# Altium project 00.Template.PrjPcb
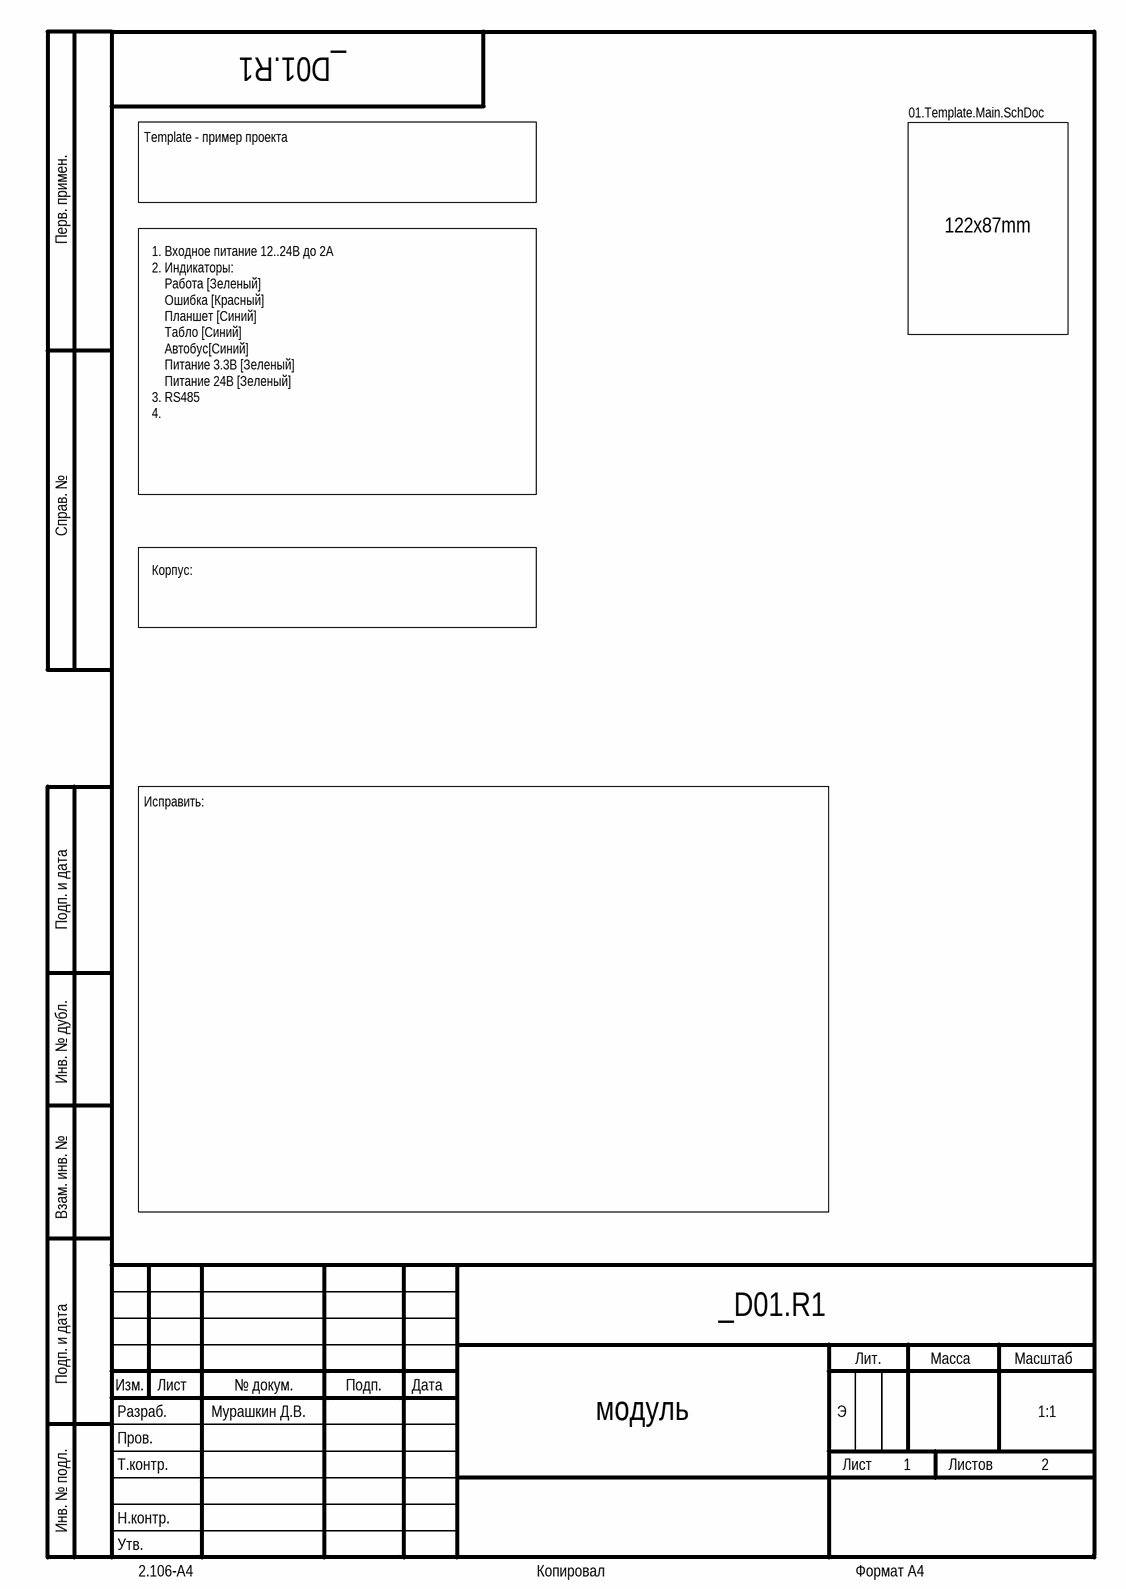
[diagram p0: 01.Template.Title.SchDoc]
7 sheets, 39 parts. Net scope: strictly hierarchical (ports join the sheet entries above them; power ports are local).
Board file: 01.Template.pcbdoc
Sheets:
  01.Template.Title.SchDoc
    01.Template.Main = 01.Template.Main.SchDoc
      MCU = 03.Template.MCU.SchDoc
        Template.MCU-sub.Power.Clock.Debug = 03.Template.MCU-sub.Power.Clock.Debug.SchDoc
      Template_connection = 02.Template_connection.SchDoc
      Debug = 03.Template_Debug.SchDoc
      Indication = 03.Template_Indication.SchDoc

## Sheet 01.Template.Title.SchDoc
size 209 x 297 mm; Author: Мурашкин Д.В.; DocumentNumber: _D01.R1; SheetNumber: 1; SheetTotal: 2; Scale: 1:1; Letter1Column: Э; PartName: модуль; DocumentsNumber: _D01.R1

### Sub-sheets
01.Template.Main = 01.Template.Main.SchDoc: no entries

### Notes on the sheet
- Template - пример проекта
- 122x87mm
- 1. Входное питание 12..24В до 2А
  2. Индикаторы:
  Работа [Зеленый]
  Ошибка [Красный]
  Планшет [Синий]
  Табло [Синий]
  Автобус[Синий]
  Питание 3.3В [Зеленый]
  Питание 24В [Зеленый]
  3. RS485
  4.
- Корпус:
- Исправить:
- Перв. примен.
- Справ. №
- Подп. и дата
- Инв. № дубл.
- Взам. инв. №
- Разраб.
- Изм.
- Лист
- № докум.
- Подп.
- Дата
- Лит.
- Масса
- Масштаб
- Пров.
- Т.контр.
- Листов
- Инв. № подл.
- Утв.
- Н.контр.
- 2.106-A4
- Копировал
- Формат А4

## Sheet 01.Template.Main.SchDoc
size 209 x 297 mm; Author: Мурашкин Д.В.; DocumentNumber: _D01.R1; SheetNumber: 2; SheetTotal: 7; Scale: 1:1; Letter1Column: Э; PartName: Блок схема
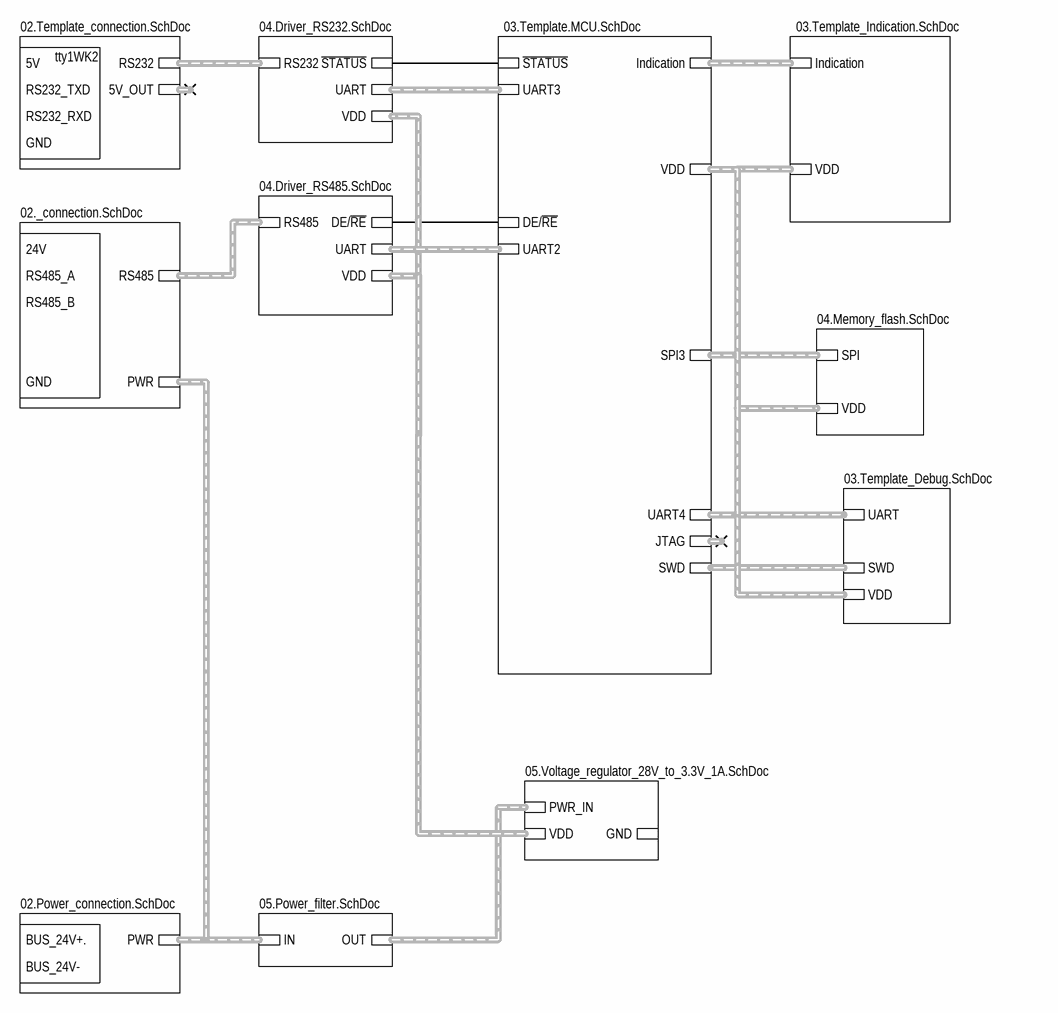
[diagram p1: 01.Template.Main.SchDoc]

### Sub-sheets
_connection = 02._connection.SchDoc (file not in this document): RS485 (harness RS485), PWR (harness PWR)
Debug = 03.Template_Debug.SchDoc: SWD (harness SWD), VDD (harness VDD), UART
Driver_RS232 = 04.Driver_RS232.SchDoc (file not in this document): UART (harness UART), RS232 (harness RS232), VDD (harness VDD), ~{STATUS}
Driver_RS485 = 04.Driver_RS485.SchDoc (file not in this document): RS485 (harness RS485), DE/~{RE}, VDD (harness VDD), UART (harness UART)
Indication = 03.Template_Indication.SchDoc: Indication (harness Indication), VDD (harness VDD)
MCU = 03.Template.MCU.SchDoc: VDD (harness VDD), Indication (harness Indication), UART3 (harness UART), UART2 (harness UART), JTAG (harness JTAG), SWD (harness SWD), SPI3 (harness SPI), DE/~{RE}, ~{STATUS}, UART4 (harness UART)
Memory_flash_MB = 04.Memory_flash.SchDoc (file not in this document): SPI (harness SPI), VDD (harness VDD)
Power_connection = 02.Power_connection.SchDoc (file not in this document): PWR (harness PWR)
Power_filter = 05.Power_filter.SchDoc (file not in this document): OUT (harness PWR), IN (harness PWR)
Template_connection = 02.Template_connection.SchDoc: RS232 (harness RS232), 5V_OUT (harness 5V)
VR_3.3V_1A = 05.Voltage_regulator_28V_to_3.3V_1A.SchDoc (file not in this document): VDD (harness VDD), PWR_IN (harness PWR), GND

### Nets
(unnamed): sheet MCU/DE/~{RE}, sheet Driver_RS485/DE/~{RE}
(unnamed): sheet MCU/~{STATUS}, sheet Driver_RS232/~{STATUS}

### Buses and harness runs
harness sheet _connection/PWR = sheet Power_connection/PWR = sheet Power_filter/IN
harness sheet _connection/RS485 = sheet Driver_RS485/RS485
harness sheet Debug/SWD = sheet MCU/SWD
harness sheet Debug/UART = sheet MCU/UART4
harness sheet Debug/VDD = sheet Indication/VDD = sheet MCU/VDD = sheet Memory_flash_MB/VDD
harness sheet Driver_RS232/RS232 = sheet Template_connection/RS232
harness sheet Driver_RS232/UART = sheet MCU/UART3
harness sheet Driver_RS232/VDD = sheet Driver_RS485/VDD = sheet VR_3.3V_1A/VDD
harness sheet Driver_RS485/UART = sheet MCU/UART2
harness sheet Indication/Indication = sheet MCU/Indication
harness sheet MCU/SPI3 = sheet Memory_flash_MB/SPI
harness sheet Power_filter/OUT = sheet VR_3.3V_1A/PWR_IN

### Notes on the sheet
- 5V
- RS232_TXD
- tty1WK2
- RS232_RXD
- GND
- 24V
- RS485_A
- RS485_B
- BUS_24V+.
- BUS_24V-
- Подп. и дата
- Инв. № дубл.
- Взам. инв. №
- Инв. № подл.
- Изм.
- Лист
- № докум.
- Подп.
- Дата
- 2.106-A4
- Копировал
- Формат А4

## Sheet 03.Template.MCU.SchDoc
size 209 x 297 mm; PartName: Микроконтроллер; Author: Мурашкин Д.В.; DocumentNumber: _D01.R1; SheetNumber: 4; SheetTotal: 4; Scale: 1:1; Letter1Column: Э; DocumentsNumber: _D01.R1
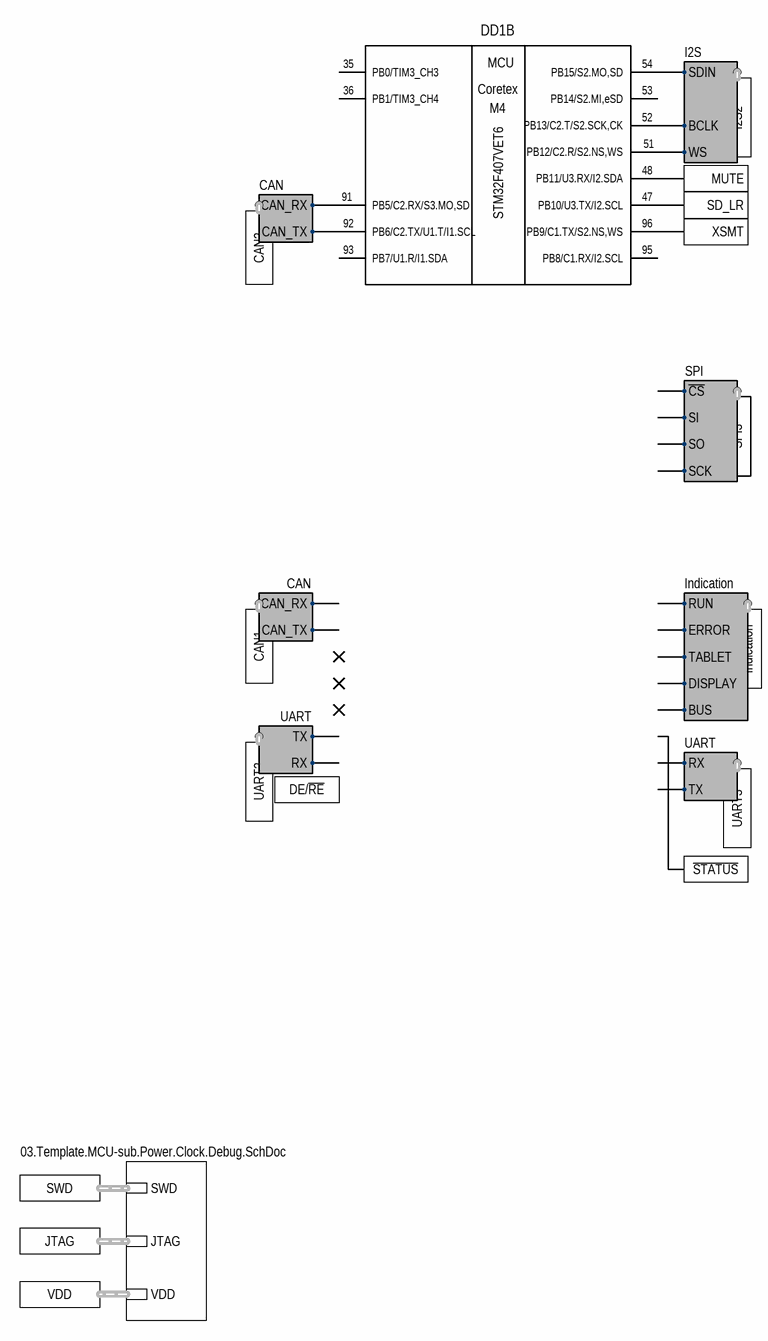
[diagram p2: 03.Template.MCU.SchDoc]

### Parts
DD1  STM32F407VET6  [LQFP-100N]  (part B of 7)

### Sub-sheets
Template.MCU-sub.Power.Clock.Debug = 03.Template.MCU-sub.Power.Clock.Debug.SchDoc: VDD (harness VDD), JTAG (harness JTAG), SWD (harness SWD)

### Ports
CAN1 (harness CAN), CAN2 (harness CAN), DE/~{RE}, I2S2 (harness I2S), Indication (harness Indication), JTAG (harness JTAG), MUTE, SD_LR, SPI3 (harness SPI), SWD (harness SWD), UART2 (harness UART), UART3 (harness UART), VDD (harness VDD), XSMT, ~{STATUS}

### Harnesses
I2S: BCLK, WS, SDIN
UART: TX, RX
CAN: CAN_RX, CAN_TX
SPI: SI, SO, SCK, ~{CS}
Indication: RUN, TABLET, ERROR, DISPLAY, BUS

### Nets
NetDD1_47: DD1.47(PB10/U3.TX/I2.SCL) ; port SD_LR
NetDD1_48: DD1.48(PB11/U3.RX/I2.SDA) ; port MUTE
NetDD1_51: DD1.51(PB12/C2.R/S2.NS,WS) ; port I2S2.WS
NetDD1_52: DD1.52(PB13/C2.T/S2.SCK,CK) ; port I2S2.BCLK
NetDD1_54: DD1.54(PB15/S2.MO,SD) ; port I2S2.SDIN
NetDD1_91: DD1.91(PB5/C2.RX/S3.MO,SD) ; port CAN2.CAN_RX
NetDD1_92: DD1.92(PB6/C2.TX/U1.T/I1.SCL) ; port CAN2.CAN_TX
NetDD1_96: DD1.96(PB9/C1.TX/S2.NS,WS) ; port XSMT

Not connected (* = marked no-connect by the designer): DD1 35(PB0/TIM3_CH3) 36(PB1/TIM3_CH4) 53(PB14/S2.MI,eSD) 93(PB7/U1.R/I1.SDA) 95(PB8/C1.RX/I2.SCL)

### Buses and harness runs
harness port JTAG = sheet Template.MCU-sub.Power.Clock.Debug/JTAG
harness port SWD = sheet Template.MCU-sub.Power.Clock.Debug/SWD
harness port VDD = sheet Template.MCU-sub.Power.Clock.Debug/VDD

### Notes on the sheet
- Подп. и дата
- Инв. № дубл.
- Взам. инв. №
- Инв. № подл.
- Изм.
- Лист
- № докум.
- Подп.
- Дата
- 2.106-A4
- Копировал
- Формат А4
- (in symbol STM32F407VET6, part B) MCU; Coretex; M4

### Library data of the parts
DD1 = STM32F407VET6: Microcontroller STM32F4 32b 168MHz 512kB Cortex-M4 LQFP-100; Manufacturer: STMicroelectronics; Core count: 1; SRAM: 192kB; Peripherals: BOD, WDT, PWM, RTC, ADC, DAC, DMA, LCD; Interfaces: GPIO, UART, SPI, JTAG, I2C, I2S, USB, CAN, LIN, DCMI, EBI/EMI, IrDA, Ethernet; Operating voltage Min: 1.8V; Operating voltage Max: 3.6V; Group: Digital; Item ID: STM32F407VET6; Part name: STM32F407VET6; Package: LQFP-100; Core: Cortex-M4; Core frequency Max: 168MHz; FLASH: 512kB; Operating temperature Min: -40°C; Operating temperature Max: +85°C; Width: 16.0mm; Length: 16.0mm; Height: 1.6mm; Mounting type: Surface mount; Supplier 1: LCSC; Supplier Part Number 1: C28730; Datasheet URL: https://www.st.com/resource/en/datasheet/stm32f407vg.pdf; Component URL: https://www.st.com/en/microcontrollers-microprocessors/stm32f407ve.html; Component: Microcontrollers; Category: STM32

## Sheet 03.Template.MCU-sub.Power.Clock.Debug.SchDoc
size 209 x 297 mm; PartName: Микроконтроллер. Подсхема ПТО; Author: Мурашкин Д.В.; DocumentNumber: _D01.R1; SheetNumber: 1; SheetTotal: 4; Scale: 1:1; Letter1Column: Э; DocumentsNumber: _D01.R1
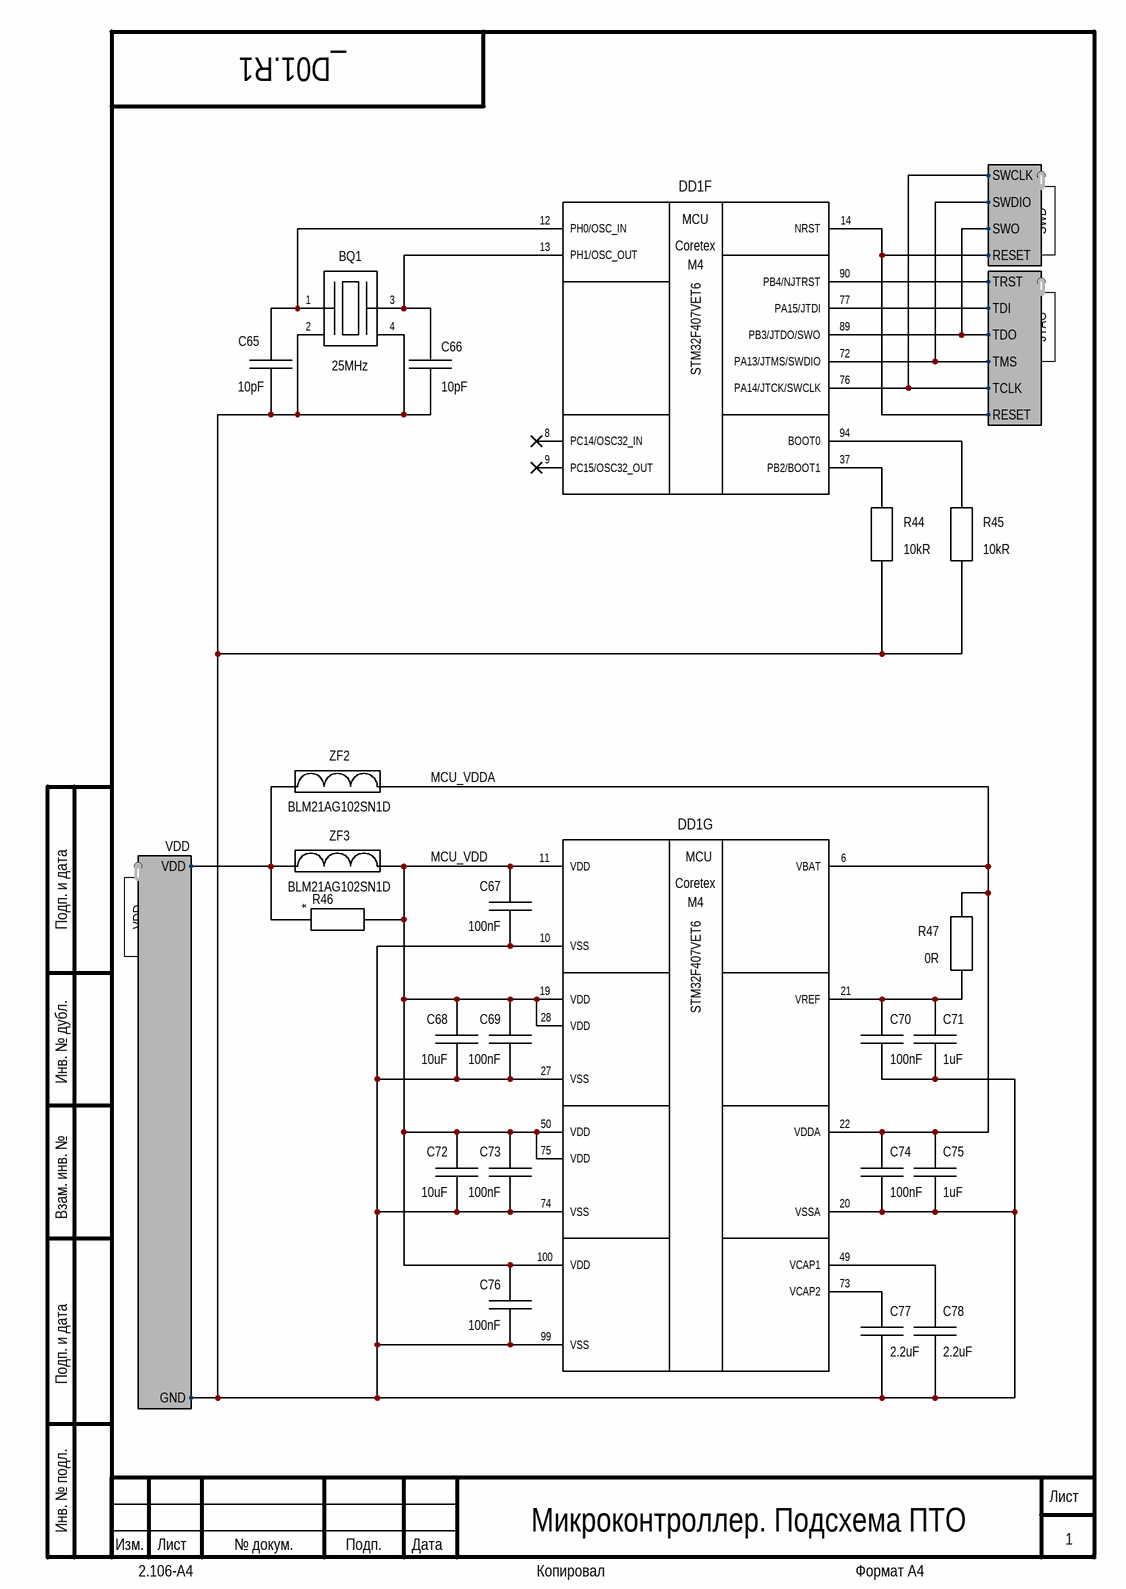
[diagram p3: 03.Template.MCU-sub.Power.Clock.Debug.SchDoc]

### Parts
BQ1  25MHz  [CRYST3225-4N]
C65  10pF  [CAPC2012N]
C66  10pF  [CAPC2012N]
C67  100nF  [CAPC2012N]
C68  10uF  [CAPC2012N]
C69  100nF  [CAPC2012N]
C70  100nF  [CAPC2012N]
C71  1uF  [CAPC2012N]
C72  10uF  [CAPC2012N]
C73  100nF  [CAPC2012N]
C74  100nF  [CAPC2012N]
C75  1uF  [CAPC2012N]
C76  100nF  [CAPC2012N]
C77  2.2uF  [CAPC2012N]
C78  2.2uF  [CAPC2012N]
DD1  STM32F407VET6  [LQFP-100N]  (parts F,G of 7)
R44  10kR  [RESC2012N]
R45  10kR  [RESC2012N]
R46  (no value)  [RESC2012N-NM]  (no BOM)
R47  0R  [RESC2012N]
ZF2  BLM21AG102SN1D  [FERB2012N]
ZF3  BLM21AG102SN1D  [FERB2012N]

### Ports
JTAG (harness JTAG), SWD (harness SWD), VDD (harness VDD)

### Harnesses
VDD: VDD, GND
JTAG: TMS, TDO, TDI, TRST, TCLK, RESET
SWD: SWCLK, SWO, SWDIO, RESET

### Nets
MCU_VDD: C67.1 C68.1 C69.1 C72.1 C73.1 C76.1 DD1.11(VDD) DD1.19(VDD) DD1.28(VDD) DD1.50(VDD) DD1.75(VDD) DD1.100(VDD) R46.2 ZF3.2
MCU_VDDA: C74.1 C75.1 DD1.6(VBAT) DD1.22(VDDA) R47.1 ZF2.2
Net3.3V_1: BQ1.2 BQ1.4 C65.2 C66.2 C67.2 C68.2 C69.2 C70.2 C71.2 C72.2 C73.2 C74.2 C75.2 C76.2 C77.2 C78.2 DD1.10(VSS) DD1.20(VSSA) DD1.27(VSS) DD1.74(VSS) DD1.99(VSS) R44.2 R45.2 ; port VDD.GND
NetBQ1_1: BQ1.1 C65.1 DD1.12(PH0/OSC_IN)
NetBQ1_3: BQ1.3 C66.1 DD1.13(PH1/OSC_OUT)
NetC70_1: C70.1 C71.1 DD1.21(VREF) R47.2
NetC77_1: C77.1 DD1.73(VCAP2)
NetC78_1: C78.1 DD1.49(VCAP1)
NetDD1_14: DD1.14(NRST) ; port JTAG.RESET, port SWD.RESET
NetDD1_37: DD1.37(PB2/BOOT1) R44.1
NetDD1_72: DD1.72(PA13/JTMS/SWDIO) ; port JTAG.TMS, port SWD.SWDIO
NetDD1_76: DD1.76(PA14/JTCK/SWCLK) ; port JTAG.TCLK, port SWD.SWCLK
NetDD1_77: DD1.77(PA15/JTDI) ; port JTAG.TDI
NetDD1_89: DD1.89(PB3/JTDO/SWO) ; port JTAG.TDO, port SWD.SWO
NetDD1_90: DD1.90(PB4/NJTRST) ; port JTAG.TRST
NetDD1_94: DD1.94(BOOT0) R45.1
NetR11_1: R46.1 ZF2.1 ZF3.1 ; port VDD.VDD

Not connected (* = marked no-connect by the designer): DD1 8(PC14/OSC32_IN)* 9(PC15/OSC32_OUT)*

### Notes on the sheet
- Подп. и дата
- Инв. № дубл.
- Взам. инв. №
- Инв. № подл.
- Изм.
- Лист
- № докум.
- Подп.
- Дата
- 2.106-A4
- Копировал
- Формат А4
- (in symbol STM32F407VET6, part F) MCU; Coretex; M4
- (in symbol STM32F407VET6, part G) MCU; Coretex; M4

### Library data of the parts
BQ1 = X322525MMB4SI: Crystal 25MHz 10pF; Manufacturer: YXC; Group: Discrete; ESR: 50kOhm; Frequency tolerance: ±10ppm; Component: Oscillators; Part name: X322525MMB4SI; Package: 3225; Frequency: 25MHz; Height: 0.75mm; Operating temperature: -40°C +85°C; Load capacitance: 10pF; Mounting type: Surface mount; Dimension: 3.20mm x 2.50mm; Item ID: X322525MMB4SI; Operating temperature Min: -40°C; Operating temperature Max: +85°C; Width: 5.2mm; Length: 2.5mm; Supplier 1: LCSC; Supplier Part Number 1: C70582; Datasheet URL: https://datasheet.lcsc.com/lcsc/2304140030_YXC-X322525MMB4SI_C70582.pdf; Category: Crystal; Value: 25MHz
C65 C66 = 0805CG100J500NT: Capacitor Ceramic 10pF 50V C0G 2012; Manufacturer: FH; Tolerance: ±5%; Group: Discrete; Component: Capacitors; Value: 10pF/50V; Value code: 100; Item ID: 0805CG100J500NT; Part name: 0805CG100J500NT; Package: 2012; Capacitance: 10pF; Voltage: 50V; Dielectric: C0G; Technology: Multi layer; Operating temperature Min: -55°C; Operating temperature Max: +125°C; Width: 1.25mm; Length: 2.0mm; Height: 0.55mm; Mounting type: Surface mount; Supplier 1: LCSC; Supplier Part Number 1: C157608; Datasheet URL: https://datasheet.lcsc.com/lcsc/2304140030_FH--Guangdong-Fenghua-Advanced-Tech-0805CG100J500NT_C157608.pdf?_gl=1*1oyk1cl*_ga*MTk2MTgyMTQ2NS4xNzA5MTMzOTYz*_ga_98M84MKSZH*MTcwOTE0MzQwMS4yLjEuMTcwOTE0NjgyMy42MC4wLjA.; Category: Ceramic
C67 C69 C70 C73 C74 C76 = 0805B104K500NT: Capacitor Ceramic 100nF 50V X7R 2012; Manufacturer: FH; Tolerance: ±10%; Group: Discrete; Component: Capacitors; Value: 100nF/50V; Value code: 104; Item ID: 0805B104K500NT; Part name: 0805B104K500NT; Package: 2012; Capacitance: 100nF; Voltage: 50V; Dielectric: X7R; Technology: Multi layer; Operating temperature Min: -55°C; Operating temperature Max: +125°C; Width: 1.25mm; Length: 2.0mm; Height: 0.8mm; Mounting type: Surface mount; Supplier 1: LCSC; Supplier Part Number 1: C38141; Datasheet URL: https://datasheet.lcsc.com/lcsc/2304140030_FH--Guangdong-Fenghua-Advanced-Tech-0805B103K500NT_C52278.pdf?_gl=1*18q9nu3*_ga*MTk2MTgyMTQ2NS4xNzA5MTMzOTYz*_ga_98M84MKSZH*MTcwOTE0MzQwMS4yLjEuMTcwOTE0NzM5MC43LjAuMA..; Category: Ceramic
C68 C72 = GRM21BR61H106KE43L: Capacitor Ceramic 10uF 50V X5R 2012; Manufacturer: Murata Electronics; Tolerance: ±10%; Group: Discrete; Component: Capacitors; Value: 10uF/50V; Value code: 106; Item ID: GRM21BR61H106KE43L; Part name: GRM21BR61H106KE43L; Package: 2012; Capacitance: 10uF; Voltage: 50V; Dielectric: X5R; Technology: Multi layer; Operating temperature Min: -55°C; Operating temperature Max: +85°C; Width: 1.25mm; Length: 2.0mm; Height: 1.25mm; Mounting type: Surface mount; Supplier 1: LCSC; Supplier Part Number 1: C440198; Datasheet URL: https://datasheet.lcsc.com/lcsc/2310251059_Murata-Electronics-GRM21BR61H106KE43L_C440198.pdf?_gl=1*1lxpbko*_ga*MTk2MTgyMTQ2NS4xNzA5MTMzOTYz*_ga_98M84MKSZH*MTcwOTE0MzQwMS4yLjEuMTcwOTE0NzE1NS42MC4wLjA.; Category: Ceramic
C71 C75 = 0805B105K500NT: Capacitor Ceramic 1uF 50V X7R 2012; Manufacturer: FH; Tolerance: ±10%; Group: Discrete; Component: Capacitors; Value: 1uF/50V; Value code: 105; Item ID: 0805B105K500NT; Part name: 0805B105K500NT; Package: 2012; Capacitance: 1uF; Voltage: 50V; Dielectric: X7R; Technology: Multi layer; Operating temperature Min: -55°C; Operating temperature Max: +125°C; Width: 1.25mm; Length: 2.0mm; Height: 0.8mm; Mounting type: Surface mount; Supplier 1: LCSC; Supplier Part Number 1: C215803; Datasheet URL: https://datasheet.lcsc.com/lcsc/2304140030_FH--Guangdong-Fenghua-Advanced-Tech-0805B103K500NT_C52278.pdf?_gl=1*18q9nu3*_ga*MTk2MTgyMTQ2NS4xNzA5MTMzOTYz*_ga_98M84MKSZH*MTcwOTE0MzQwMS4yLjEuMTcwOTE0NzM5MC43LjAuMA..; Category: Ceramic
C77 C78 = 0805X225K500NT: Capacitor Ceramic 2.2uF 50V X5R 2012; Manufacturer: FH; Tolerance: ±15%; Group: Discrete; Component: Capacitors; Value: 2.2uF/50V; Value code: 225; Item ID: 0805X225K500NT; Part name: 0805X225K500NT; Package: 2012; Capacitance: 2.2uF; Voltage: 50V; Dielectric: X5R; Technology: Multi layer; Operating temperature Min: -55°C; Operating temperature Max: +85°C; Width: 1.25mm; Length: 2.0mm; Height: 0.8mm; Mounting type: Surface mount; Supplier 1: LCSC; Supplier Part Number 1: C108719; Datasheet URL: https://datasheet.lcsc.com/lcsc/2304140030_FH--Guangdong-Fenghua-Advanced-Tech-0805X225K500NT_C108719.pdf?_gl=1*1vi7l0*_ga*MTk2MTgyMTQ2NS4xNzA5MTMzOTYz*_ga_98M84MKSZH*MTcwOTE0MzQwMS4yLjEuMTcwOTE0NzU5NC42MC4wLjA.; Category: Ceramic
DD1 = STM32F407VET6: as DD1 on sheet 03.Template.MCU; Item ID: STM32F407VET6; Part name: STM32F407VET6; Package: LQFP-100; Core: Cortex-M4; Core frequency Max: 168MHz; FLASH: 512kB; Operating temperature Min: -40°C; Operating temperature Max: +85°C; Width: 16.0mm; Length: 16.0mm; Height: 1.6mm; Mounting type: Surface mount; Supplier 1: LCSC; Supplier Part Number 1: C28730; Datasheet URL: https://www.st.com/resource/en/datasheet/stm32f407vg.pdf; Component URL: https://www.st.com/en/microcontrollers-microprocessors/stm32f407ve.html; Component: Microcontrollers; Category: STM32
R44 R45 = 0805W8F1002T5E: Resistor Ceramic 10kR 1% 2012; Manufacturer: UNI-ROYAL; Power: 125mW; Temperature coefficient: ±100ppm; Group: Discrete; Component: Resistors; Value code: 1002; Item ID: 0805W8F1002T5E; Part name: 0805W8F1002T5E; Package: 2012; Resistance: 10kR; Tolerance: ±1%; Technology: Thin film; Operating temperature Min: -55°C; Operating temperature Max: +125°C; Width: 1.25mm; Length: 2.0mm; Height: 0.55mm; Mounting type: Surface mount; Supplier 1: LCSC; Supplier Part Number 1: C17414; Datasheet URL: https://datasheet.lcsc.com/lcsc/2206010216_UNI-ROYAL-Uniroyal-Elec-0805W8F1912T5E_C17508.pdf?_gl=1*13rsoe6*_ga*MTk2MTgyMTQ2NS4xNzA5MTMzOTYz*_ga_98M84MKSZH*MTcwOTE1NjkxMy4zLjEuMTcwOTE1OTk5Ni41NS4wLjA.; Category: Ceramic; Value: 10kR
R46 = RESC NM 2012: Part name: RESC2012_NM; Mounting type: Not mount; Group: Discrete; Component: Resistors; Item ID: RESC NM 2012; Package: 2012; Width: 2.0mm; Length: 1.25mm; Height: 0.55mm; Category: Ceramic
R47 = 0805W8F0000T5E: Resistor Ceramic 0R 1% 2012; Manufacturer: UNI-ROYAL; Power: 125mW; Temperature coefficient: ±100ppm; Group: Discrete; Component: Resistors; Value code: 0; Item ID: 0805W8F0000T5E; Part name: 0805W8F0000T5E; Package: 2012; Resistance: 0R; Tolerance: ±1%; Technology: Thin film; Operating temperature Min: -55°C; Operating temperature Max: +125°C; Width: 1.25mm; Length: 2.0mm; Height: 0.55mm; Mounting type: Surface mount; Supplier 1: LCSC; Supplier Part Number 1: C17477; Datasheet URL: https://datasheet.lcsc.com/lcsc/2206010216_UNI-ROYAL-Uniroyal-Elec-0805W8F0000T5E_C17477.pdf?_gl=1*s59qgl*_ga*MTk2MTgyMTQ2NS4xNzA5MTMzOTYz*_ga_98M84MKSZH*MTcwOTE1NjkxMy4zLjEuMTcwOTE1ODA5Mi42MC4wLjA.; Category: Ceramic; Value: 0R
ZF2 ZF3 = BLM21AG102SN1D: Ferrite Bead 0.6A 1k/100MHz 2012; Manufacturer: Murata Electronics; DC resistance: 280mOhm; Group: Discrete; Component: Filters; Impedance resistance: 1kOhm; Impedance frequency: 100MHz; Item ID: BLM21AG102SN1D; Part name: BLM21AG102SN1D; Package: 2012; Current rated: 0.6A; Operating temperature Min: -55°C; Operating temperature Max: +125°C; Width: 1.2mm; Length: 2.0mm; Height: 1.05mm; Mounting type: Surface mount; Supplier 1: LCSC; Supplier Part Number 1: C85835; Datasheet URL: https://www.murata.com/en-us/products/en-us/products/productdata/8796738977822/ENFA0005.pdf; Component URL: https://www.murata.com/en-global/products/productdetail?partno=BLM21AG102SN1%23; Category: Beads; Value: 0.6A

## Sheet 02.Template_connection.SchDoc
size 209 x 297 mm; Author: Мурашкин Д.В.; DocumentNumber: AB_BUSM_D01.R1; SheetNumber: 3; SheetTotal: 20; Scale: 1:1; Letter1Column: Э; PartName: Подключение к планшету; CompanyName: Innoforce.kz; DocumentsNumber: AB_BUSM_D01.R1
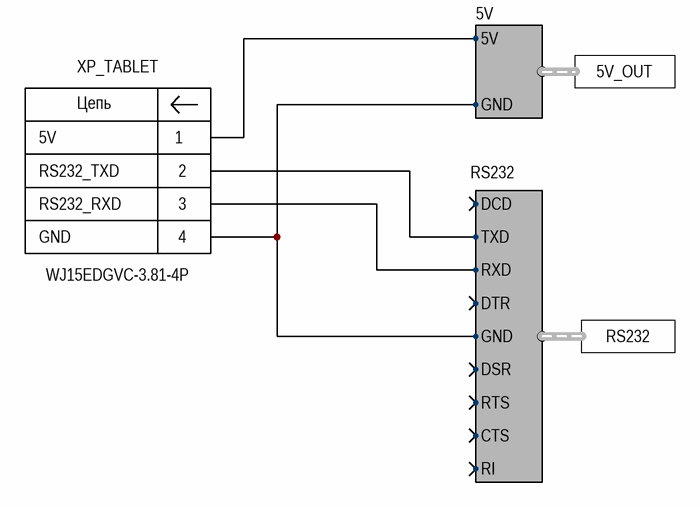
[diagram p4: 02.Template_connection.SchDoc]

### Parts
XP_TABLET  WJ15EDGVC-3.81-4P  [CON-TER-PLG-3.81-4V-TH-A-N]

### Ports
5V_OUT (harness 5V), RS232 (harness RS232)

### Harnesses
RS232: RXD, TXD, GND, DCD, DTR, DSR, RTS, CTS, RI
5V: 5V, GND

### Nets
NetXP_TABLET_1: XP_TABLET.1 ; port 5V_OUT.5V
NetXP_TABLET_2: XP_TABLET.2 ; port RS232.TXD
NetXP_TABLET_3: XP_TABLET.3 ; port RS232.RXD
NetXP_TABLET_4: XP_TABLET.4 ; port RS232.GND, port 5V_OUT.GND

### Notes on the sheet
- 5V
- RS232_TXD
- RS232_RXD
- GND
- Подп. и дата
- Инв. № дубл.
- Взам. инв. №
- Инв. № подл.
- Изм.
- Лист
- № докум.
- Подп.
- Дата
- 2.106-A4
- Копировал
- Формат А4
- (in symbol WJ15EDGVC-3.81-4P) Цепь

### Library data of the parts
XP_TABLET = WJ15EDGVC-3.81-4P: TERM BLOCK 3.81 VERT BOARD; Manufacturer: Ningbo Kangnex Elec; Pitch: 3.81; Row spacing: 0; Positions: 4; Rows: 1; Placing: Vertical; Series name: Pluggable Terminal Blocks; Connector type: Terminal plugable; Shrouding: 4 Wall; Voltage rating: 300; Current rating: 8.0; Group: Mechanical; Component: Connectors; System: Connector; Item ID: WJ15EDGVC-3.81-4P; Part name: WJ15EDGVC-3.81-4P; Package: CON-TER-PLG-3.81-4V-TH-A; Contact type: Male pin; Series: WJ15EDG; Fastening type: Friction lock; Connector style: Board; Insulation color: Green; Contact finish: Tin; Operating temperature Min: -40; Operating temperature Max: +105; Width: 7.00; Length: 16.12; Height: 9.15; Mounting type: Through hole; Supplier 1: LCSC; Supplier Part Number 1: C8410; Datasheet URL: https://datasheet.lcsc.com/lcsc/1912251633_Ningbo-Kangnex-Elec-WJ15EDGVC-3-81-4P_C8410.pdf?_gl=1*1co0dqv*_ga*MTY0NDk5MzUwOC4xNzA4NzUzMTA0*_ga_98M84MKSZH*MTcwODk4MDUzOS4xMy4wLjE3MDg5ODA5NjYuNjAuMC4w; Component URL: http://kangnex.com/product/0-70.html; Category: Terminal

## Sheet 03.Template_Debug.SchDoc
size 209 x 297 mm; Author: Мурашкин Д.В.; CompanyName: Innoforce.kz; DocumentNumber: AB_BUSM_D01.R1; SheetNumber: 9; SheetTotal: 20; Scale: 1:1; Letter1Column: Э; PartName: Разъём программирования и отладки; DocumentsNumber: AB_BUSM_D01.R1
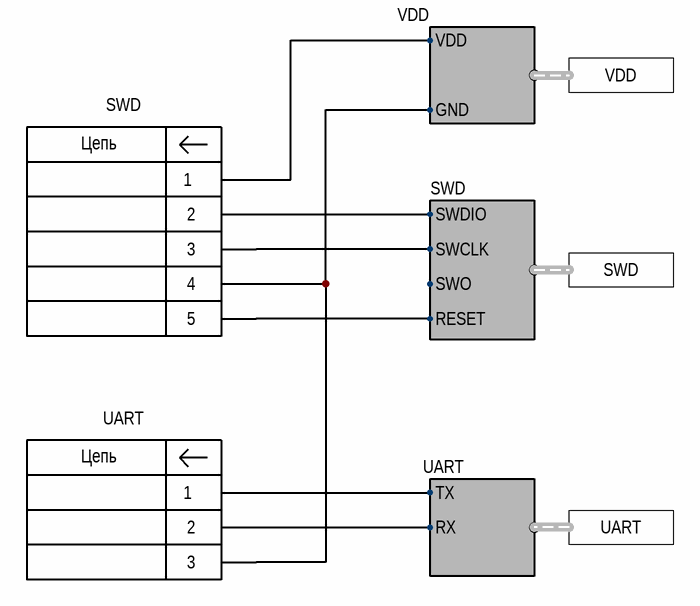
[diagram p5: 03.Template_Debug.SchDoc]

### Parts
SWD  SWDR-2.54-5  [SWDR-2.54-5]  (value not drawn)  (no BOM)
UART  UART-2.54-3  [UART-2.54-3]  (value not drawn)  (no BOM)

### Ports
SWD (harness SWD), UART (harness UART), VDD (harness VDD)

### Harnesses
SWD: SWCLK, SWO, SWDIO, RESET
VDD: VDD, GND
UART: TX, RX

### Nets
Net3.3V_1: SWD.4 UART.3 ; port VDD.GND
NetDD1_14: SWD.5 ; port SWD.RESET
NetDD1_72: SWD.2 ; port SWD.SWDIO
NetDD1_76: SWD.3 ; port SWD.SWCLK
NetR11_1: SWD.1 ; port VDD.VDD
NetUART_1: UART.1 ; port UART.TX
NetUART_2: UART.2 ; port UART.RX

### Notes on the sheet
- Подп. и дата
- Инв. № дубл.
- Взам. инв. №
- Инв. № подл.
- Изм.
- Лист
- № докум.
- Подп.
- Дата
- 2.106-A4
- Копировал
- Формат А4
- (in symbol SWDR-2.54-5) Цепь
- (in symbol UART-2.54-3) Цепь

### Library data of the parts
SWD = SWDR-2.54-5: Connector Debug SWD + Reset PCB-PAD-2.54-5; Pitch: 2.54; Row spacing: 0; Positions: 5; Rows: 1; Placing: Vertical; Connector type: Board pads; Connector style: Board; Shrouding: Not; Group: Mechanical; Component: Connectors; Item ID: SWDR-2.54-5; Part name: SWDR-2.54-5; Package: PCB-PAD-2.54-5; Contact type: Board hole pad; Series name: SWD; Width: 3.0mm; Length: 13.2mm; Height: 0.0mm; Mounting type: Through hole; Category: Debug
UART = UART-2.54-3: Connector Debug UART PCB-PAD-2.54-3; Pitch: 2.54; Row spacing: 0; Positions: 3; Rows: 1; Placing: Vertical; Series name: Serial; Connector type: Board pads; Connector style: Board; Shrouding: Not; Group: Mechanical; Component: Connectors; Item ID: UART-2.54-3; Part name: UART-2.54-3; Package: PCB-PAD-2.54-3; Contact type: Board hole pad; Width: 3.0mm; Length: 8.0mm; Height: 0.0mm; Mounting type: Through hole; Category: Debug

## Sheet 03.Template_Indication.SchDoc
size 209 x 297 mm; Author: Мурашкин Д.В.; DocumentNumber: AB_BUSM_D01.R1; SheetNumber: 8; SheetTotal: 20; Scale: 1:1; Letter1Column: Э; PartName: Светодиодная индикация; CompanyName: Innoforce.kz; DocumentsNumber: AB_BUSM_D01.R1
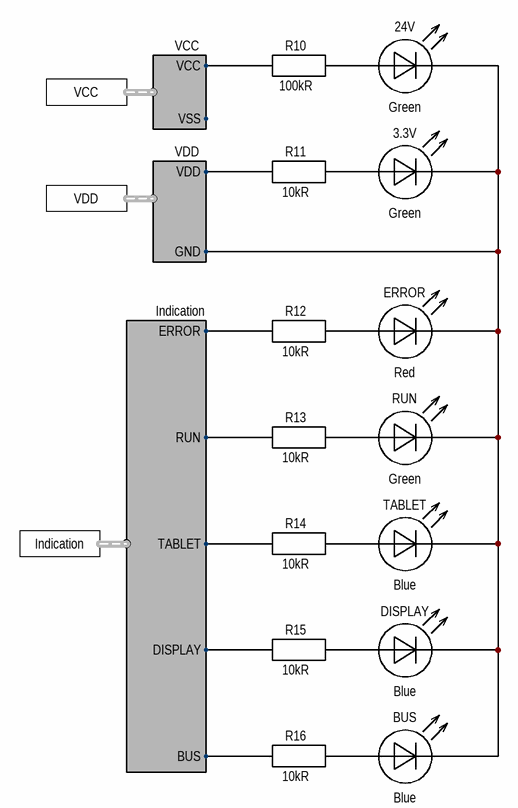
[diagram p6: 03.Template_Indication.SchDoc]

### Parts
3.3V  Green  [LED2012N]
24V  Green  [LED2012N]
BUS  Blue  [LED2012N]
DISPLAY  Blue  [LED2012N]
ERROR  Red  [LED2012N]
R10  100kR  [RESC2012N]
R11  10kR  [RESC2012N]
R12  10kR  [RESC2012N]
R13  10kR  [RESC2012N]
R14  10kR  [RESC2012N]
R15  10kR  [RESC2012N]
R16  10kR  [RESC2012N]
RUN  Green  [LED2012N]
TABLET  Blue  [LED2012N]

### Ports
Indication (harness Indication), VCC (harness VCC), VDD (harness VDD)

### Harnesses
Indication: RUN, TABLET, ERROR, DISPLAY, BUS
VDD: VDD, GND
VCC: VCC, VSS

### Nets
Net3.3V_1: 3.3V.1 24V.1 BUS.1 DISPLAY.1 ERROR.1 RUN.1 TABLET.1 ; port VDD.GND
Net3.3V_2: 3.3V.2 R11.2
Net24V_2: 24V.2 R10.2
NetBUS_2: BUS.2 R16.2
NetDISPLAY_2: DISPLAY.2 R15.2
NetERROR_2: ERROR.2 R12.2
NetR10_1: R10.1 ; port VCC.VCC
NetR11_1: R11.1 ; port VDD.VDD
NetR12_1: R12.1 ; port Indication.ERROR
NetR13_1: R13.1 ; port Indication.RUN
NetR13_2: R13.2 RUN.2
NetR14_1: R14.1 ; port Indication.TABLET
NetR14_2: R14.2 TABLET.2
NetR15_1: R15.1 ; port Indication.DISPLAY
NetR16_1: R16.1 ; port Indication.BUS

### Notes on the sheet
- Подп. и дата
- Инв. № дубл.
- Взам. инв. №
- Инв. № подл.
- Изм.
- Лист
- № докум.
- Подп.
- Дата
- 2.106-A4
- Копировал
- Формат А4

### Library data of the parts
3.3V 24V RUN = XL-2012UGC: Led Indication Green 2012; Manufacturer: XINGLIGHT; Wavelength: 525nm; Forward current: 30mA; Forward voltage: 3.2V; Group: Discrete; Item ID: XL-2012UGC; Part name: XL-2012UGC; Package: 2012; Color: Green; Operating temperature Min: -30°C; Operating temperature Max: +85°C; Width: 1.2mm; Length: 2.1mm; Height: 0.9mm; Mounting type: Surface mount; Supplier 1: LCSC; Supplier Part Number 1: C965815; Datasheet URL: http://www.xinglight.cn/uploadfile/202301/2127a4773e74ed4.pdf; Component URL: http://www.xinglight.cn/index.php?c=show&id=1071; Component: LED; Category: Indication; Value: Green
BUS DISPLAY TABLET = XL-2012UBC: Led Indication Blue 2012; Manufacturer: XINGLIGHT; Wavelength: 470nm; Forward current: 30mA; Forward voltage: 3.1V; Group: Discrete; Item ID: XL-2012UBC; Part name: XL-2012UBC; Package: 2012; Color: Blue; Operating temperature Min: -30°C; Operating temperature Max: +85°C; Width: 1.2mm; Length: 2.1mm; Height: 0.9mm; Mounting type: Surface mount; Supplier 1: LCSC; Supplier Part Number 1: C965817; Datasheet URL: http://www.xinglight.cn/uploadfile/202301/0b25401bf42e5d4.pdf; Component URL: http://www.xinglight.cn/index.php?c=show&id=1073; Component: LED; Category: Indication; Value: Blue
ERROR = XL-2012SURC: Led Indication Red 2012; Manufacturer: XINGLIGHT; Wavelength: 620nm; Forward current: 30mA; Forward voltage: 2.1V; Group: Discrete; Item ID: XL-2012SURC; Part name: XL-2012SURC; Package: 2012; Color: Red; Operating temperature Min: -30°C; Operating temperature Max: +85°C; Width: 1.2mm; Length: 2.1mm; Height: 0.9mm; Mounting type: Surface mount; Supplier 1: LCSC; Supplier Part Number 1: C965812; Datasheet URL: http://www.xinglight.cn/uploadfile/202301/06a5a26956f942a.pdf; Component URL: http://www.xinglight.cn/index.php?c=show&id=1068; Component: LED; Category: Indication; Value: Red
R10 = 0805W8F1003T5E: Resistor Ceramic 100kR 1% 2012; Manufacturer: UNI-ROYAL; Power: 125mW; Temperature coefficient: ±100ppm; Group: Discrete; Component: Resistors; Value code: 1003; Item ID: 0805W8F1003T5E; Part name: 0805W8F1003T5E; Package: 2012; Resistance: 100kR; Tolerance: ±1%; Technology: Thin film; Operating temperature Min: -55°C; Operating temperature Max: +125°C; Width: 1.25mm; Length: 2.0mm; Height: 0.55mm; Mounting type: Surface mount; Supplier 1: LCSC; Supplier Part Number 1: C149504; Datasheet URL: https://datasheet.lcsc.com/lcsc/2206010216_UNI-ROYAL-Uniroyal-Elec-0805W8F191JT5E_C17509.pdf?_gl=1*glxx84*_ga*MTk2MTgyMTQ2NS4xNzA5MTMzOTYz*_ga_98M84MKSZH*MTcwOTE1NjkxMy4zLjEuMTcwOTE1ODg4Ny42MC4wLjA.; Category: Ceramic; Value: 100kR
R11-R16 = 0805W8F1002T5E: as R44 on sheet 03.Template.MCU-sub.Power.Clock.Debug; Item ID: 0805W8F1002T5E; Part name: 0805W8F1002T5E; Package: 2012; Resistance: 10kR; Tolerance: ±1%; Technology: Thin film; Operating temperature Min: -55°C; Operating temperature Max: +125°C; Width: 1.25mm; Length: 2.0mm; Height: 0.55mm; Mounting type: Surface mount; Supplier 1: LCSC; Supplier Part Number 1: C17414; Datasheet URL: https://datasheet.lcsc.com/lcsc/2206010216_UNI-ROYAL-Uniroyal-Elec-0805W8F1912T5E_C17508.pdf?_gl=1*13rsoe6*_ga*MTk2MTgyMTQ2NS4xNzA5MTMzOTYz*_ga_98M84MKSZH*MTcwOTE1NjkxMy4zLjEuMTcwOTE1OTk5Ni41NS4wLjA.; Category: Ceramic; Value: 10kR

## Nets that join several sheets
Net3.3V_1: 03.Template.MCU-sub.Power.Clock.Debug (23 pins), 03.Template_Debug (SWD.4 UART.3), 03.Template_Indication (7 pins)
NetDD1_14: 03.Template.MCU-sub.Power.Clock.Debug (DD1.14), 03.Template_Debug (SWD.5)
NetDD1_72: 03.Template.MCU-sub.Power.Clock.Debug (DD1.72), 03.Template_Debug (SWD.2)
NetDD1_76: 03.Template.MCU-sub.Power.Clock.Debug (DD1.76), 03.Template_Debug (SWD.3)
NetR11_1: 03.Template.MCU-sub.Power.Clock.Debug (R46.1 ZF2.1 ZF3.1), 03.Template_Debug (SWD.1), 03.Template_Indication (R11.1)